# Altium project BK1096.PrjPcb
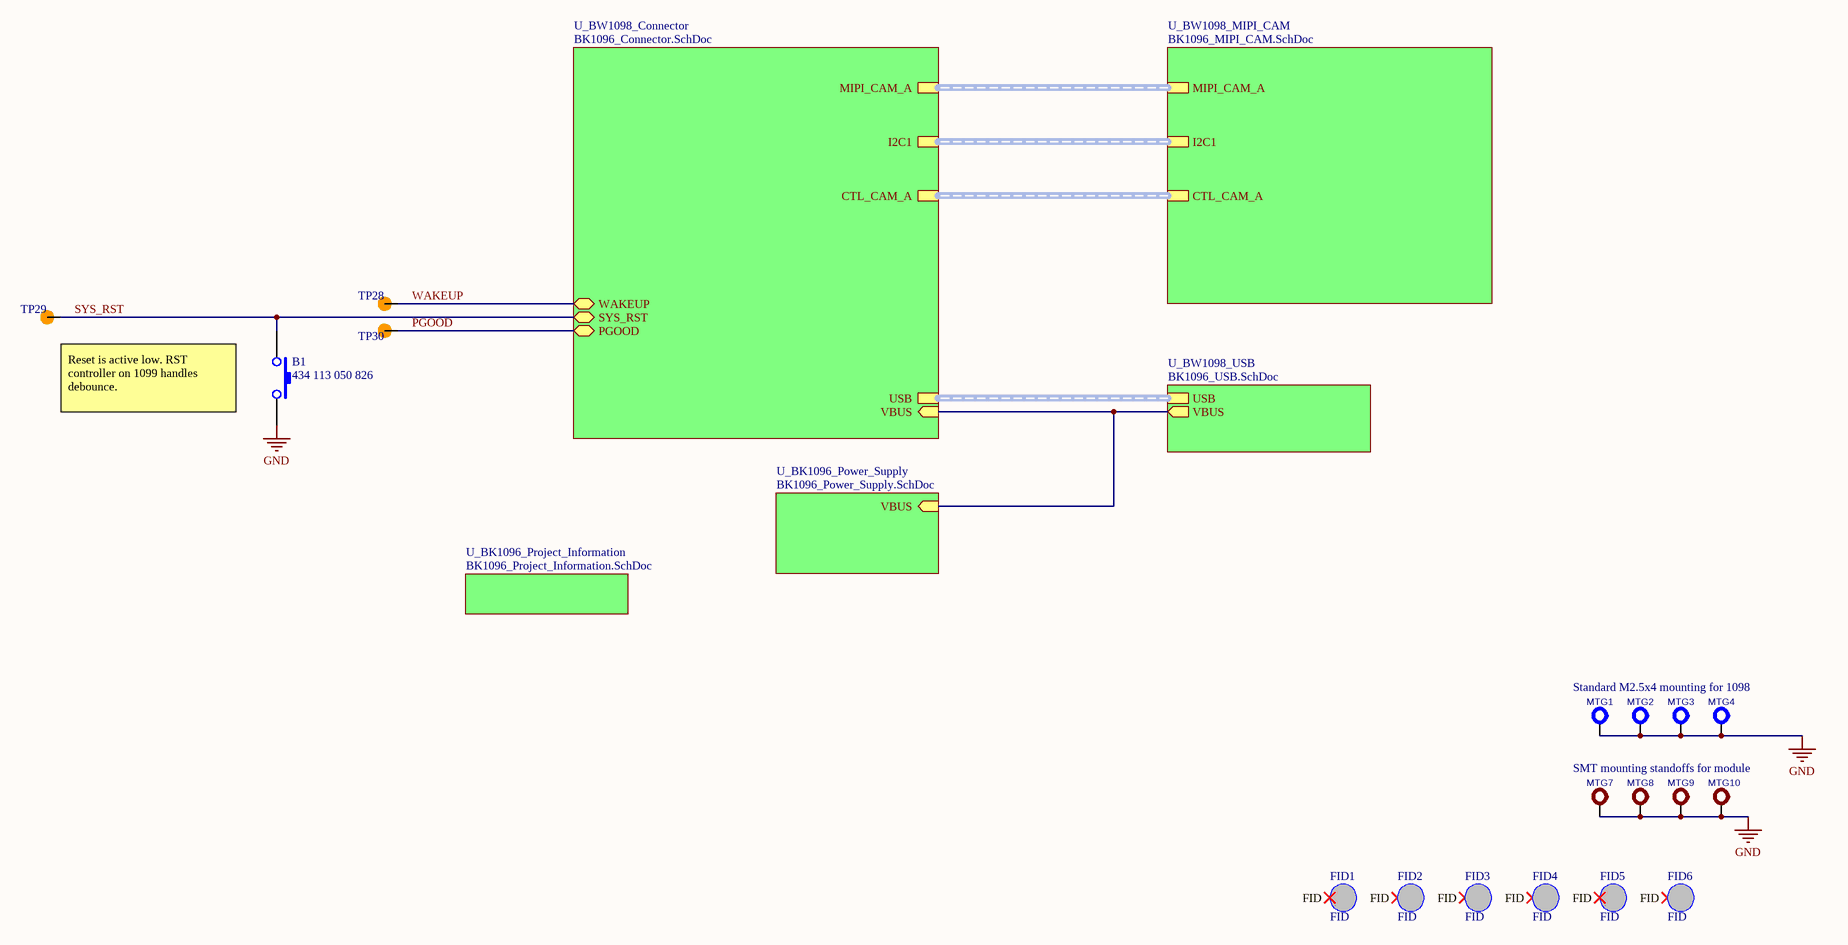
[diagram p0: BK1096_TopLevel.SchDoc]
revision1: R1M0E1; project_title: BK1096; drawn_by: Blaž Kvas; document_number: D000
6 sheets, 104 parts. Net scope: hierarchical (ports join the sheet entries above them; power ports are global).
Board file: BK1096.PcbDoc
Sheets:
  BK1096_TopLevel.SchDoc
    U_BW1098_Connector = BK1096_Connector.SchDoc
    U_BW1098_MIPI_CAM = BK1096_MIPI_CAM.SchDoc
    U_BW1098_USB = BK1096_USB.SchDoc
    U_BK1096_Power_Supply = BK1096_Power_Supply.SchDoc
    U_BK1096_Project_Information = BK1096_Project_Information.SchDoc

## Sheet BK1096_TopLevel.SchDoc: =project_title
size Tabloid; PageSetup: Record=PageOptions|CenterHorizontal=True|CenterVertical=True|PrintScale=0.73|XCorrection=1.00|YCorrection=1.00|PrintKind=0|BorderSize=5000000|LeftOffset=0|BottomOffset=0|Orientation=2|PaperLength=1000|PaperWidth=1000|Scale=100|PaperSource=7|PrintQuality=-4|MediaType=1|DitherType=10|PaperKind=A4|PrintScaleMode=1; CompanyName: Luxonis Holding; DrawnBy: Blaž Kvas; Organization: Luxonis Holding; Address1: 1925 Harmony Park Drive; Address2: Westminster, CO; Address3: 80234; Address4: United States; DocumentNumber: D000; Revision: R1M0E1; SheetNumber: 1; SheetTotal: 6

### Parts
B1  434 113 050 826  [DTSM32N]
FID1  FID  [FIDUCIAL_1MM]  (no BOM)
FID2  FID  [FIDUCIAL_1MM]  (no BOM)
FID3  FID  [FIDUCIAL_1MM]  (no BOM)
FID4  FID  [FIDUCIAL_1MM]  (no BOM)
FID5  FID  [FIDUCIAL_1MM]  (no BOM)
FID6  FID  [FIDUCIAL_1MM]  (no BOM)
MTG1  MTG-HOLE  [SCREW_M2.5x4_RPi]  (value not drawn)  (no BOM)
MTG2  MTG-HOLE  [SCREW_M2.5x4_RPi]  (value not drawn)  (no BOM)
MTG3  MTG-HOLE  [SCREW_M2.5x4_RPi]  (value not drawn)  (no BOM)
MTG4  MTG-HOLE  [SCREW_M2.5x4_RPi]  (value not drawn)  (no BOM)
MTG7  MTG-HOLE  [STANDOFF_M2X0.4_3MM]  (value not drawn)
MTG8  MTG-HOLE  [STANDOFF_M2X0.4_3MM]  (value not drawn)
MTG9  MTG-HOLE  [STANDOFF_M2X0.4_3MM]  (value not drawn)
MTG10  MTG-HOLE  [STANDOFF_M2X0.4_3MM]  (value not drawn)
TP28  TP_SMD  [TP_0.75MM_SMD_NO-SILK]  (value not drawn)  (no BOM)
TP29  TP_SMD  [TP_0.75MM_SMD_NO-SILK]  (value not drawn)  (no BOM)
TP30  TP_SMD  [TP_0.75MM_SMD_NO-SILK]  (value not drawn)  (no BOM)

### Sub-sheets
U_BK1096_Power_Supply = BK1096_Power_Supply.SchDoc: VBUS (in)
U_BK1096_Project_Information = BK1096_Project_Information.SchDoc: no entries
U_BW1098_Connector = BK1096_Connector.SchDoc: MIPI_CAM_A (harness MIPI_CAM_A), I2C1 (harness I2C1), PGOOD (bidir), SYS_RST (bidir), WAKEUP (bidir), CTL_CAM_A (harness CTL_CAM_A), USB (harness USB), VBUS (in)
U_BW1098_MIPI_CAM = BK1096_MIPI_CAM.SchDoc: I2C1 (harness I2C1), MIPI_CAM_A (harness MIPI_CAM_A), CTL_CAM_A (harness CTL_CAM_A)
U_BW1098_USB = BK1096_USB.SchDoc: USB (harness USB), VBUS (out)

### Nets
GND: B1.2 MTG1.1 MTG2.1 MTG3.1 MTG4.1 MTG7.1 MTG8.1 MTG9.1 MTG10.1
VBUS: sheet U_BW1098_Connector/VBUS, sheet U_BW1098_USB/VBUS, sheet U_BK1096_Power_Supply/VBUS
PGOOD: TP30.1 ; sheet U_BW1098_Connector/PGOOD
SYS_RST: B1.1 TP29.1 ; sheet U_BW1098_Connector/SYS_RST
WAKEUP: TP28.1 ; sheet U_BW1098_Connector/WAKEUP

Not connected (* = marked no-connect by the designer): FID1 FID*; FID2 FID*; FID3 FID*; FID4 FID*; FID5 FID*; FID6 FID*

### Buses and harness runs
harness sheet U_BW1098_Connector/CTL_CAM_A = sheet U_BW1098_MIPI_CAM/CTL_CAM_A
harness sheet U_BW1098_Connector/I2C1 = sheet U_BW1098_MIPI_CAM/I2C1
harness sheet U_BW1098_Connector/MIPI_CAM_A = sheet U_BW1098_MIPI_CAM/MIPI_CAM_A
harness sheet U_BW1098_Connector/USB = sheet U_BW1098_USB/USB

### Notes on the sheet
- Reset is active low. RST controller on 1099 handles debounce.
- Standard M2.5x4 mounting for 1098
- SMT mounting standoffs for module
- Title
- Size:
- Date:
- Tabloid
- Number:
- Time:
- Revision:
- Sheet
- of
- Drawn by:

### Library data of the parts
B1 = SW-PB: Wurth 434 113 050 826; DIST: Farnell; DIST PN: 1868029; ICCO PN: M1V00020; MAN: Wurth; MAN PN: 434 113 050 826
FID1-FID6 = FID: Fiducial mark; MAN PN: No part on PCB; MAN: Fiducial
MTG1-MTG4 = MTG-HOLE: Mounting Hole; B - Value: Not a Part; A - Level: 0; Z - SMD or PTH: PTH; F - MFG P/N: Not a Part; D - my Footprint: SCREW_M2.5x4_RPi
MTG7-MTG10 = MTG-HOLE_B: Mounting Hole; B - Value: Not a Part; A - Level: 0; Z - SMD or PTH: PTH; F - MFG P/N: Not a Part; D - my Footprint: STANDOFF_M2X0.4_3MM
TP28-TP30 = TP_SMD: circular pad test point, SMD

## Sheet BK1096_Connector.SchDoc: =project_title
size Tabloid; CompanyName: Luxonis Holding; DrawnBy: Blaž Kvas; Organization: Luxonis Holding; Address1: 1925 Harmony Park Drive; Address2: Westminster, CO; Address3: 80234; Address4: United States; DocumentNumber: D000; Revision: R1M0E1; SheetNumber: 3; SheetTotal: 6
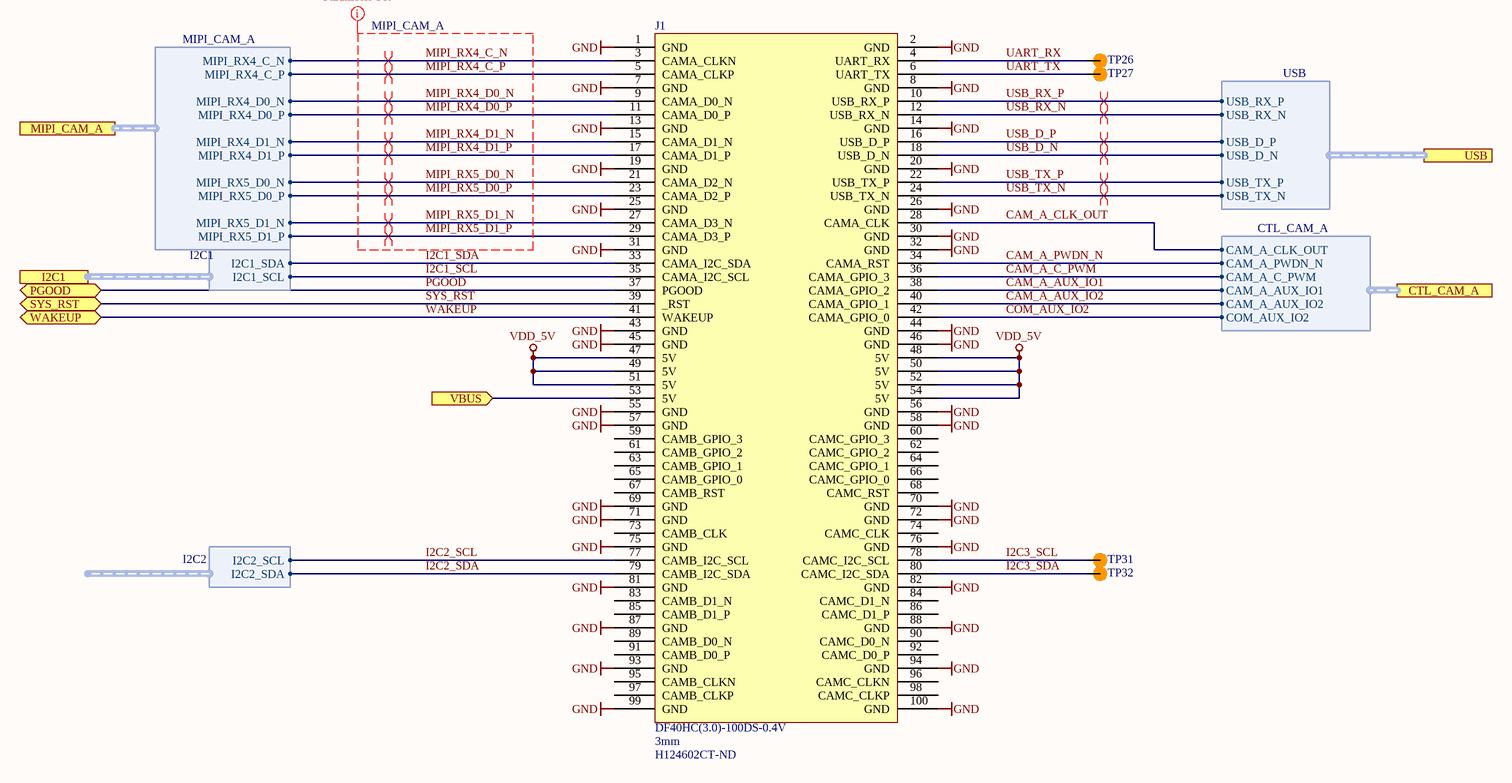
[diagram p1: BK1096_Connector.SchDoc]

### Parts
J1  DF40HC(3.0)-100DS-0.4V  Mated Stacking Heights: 3mm  Supplier Part Number 1: H124602CT-ND  [DF40HC-3.0-100DS-0.4V]
TP26  TP_SMD  [TP_0.75MM_SMD_NO-SILK]  (value not drawn)  (no BOM)
TP27  TP_SMD  [TP_0.75MM_SMD_NO-SILK]  (value not drawn)  (no BOM)
TP31  TP_SMD  [TP_0.75MM_SMD_NO-SILK]  (value not drawn)  (no BOM)
TP32  TP_SMD  [TP_0.75MM_SMD_NO-SILK]  (value not drawn)  (no BOM)

### Ports
CTL_CAM_A (harness CTL_CAM_A), I2C1 (harness I2C1), MIPI_CAM_A (harness MIPI_CAM_A), PGOOD (bidir), SYS_RST (bidir), USB (harness USB), VBUS (in), WAKEUP (bidir)

### Harnesses
MIPI_CAM_A: MIPI_RX4_C_P, MIPI_RX4_C_N, MIPI_RX4_D0_P, MIPI_RX4_D0_N, MIPI_RX4_D1_P, MIPI_RX4_D1_N, MIPI_RX5_D0_P, MIPI_RX5_D0_N, MIPI_RX5_D1_P, MIPI_RX5_D1_N
I2C2: I2C2_SDA, I2C2_SCL
I2C1: I2C1_SDA, I2C1_SCL
USB: USB_D_P, USB_D_N, USB_TX_N, USB_TX_P, USB_RX_N, USB_RX_P
CTL_CAM_A: CAM_A_C_PWM, CAM_A_AUX_IO1, CAM_A_AUX_IO2, COM_AUX_IO2, CAM_A_PWDN_N, CAM_A_CLK_OUT

### Nets
GND: J1.1(GND) J1.2(GND) J1.7(GND) J1.8(GND) J1.13(GND) J1.14(GND) J1.19(GND) J1.20(GND) J1.25(GND) J1.26(GND) J1.30(GND) J1.31(GND) J1.32(GND) J1.43(GND) J1.44(GND) J1.45(GND) J1.46(GND) J1.55(GND) J1.56(GND) J1.57(GND) J1.58(GND) J1.69(GND) J1.70(GND) J1.71(GND) J1.72(GND) J1.75(GND) J1.76(GND) J1.81(GND) J1.82(GND) J1.87(GND) J1.88(GND) J1.93(GND) J1.94(GND) J1.99(GND) J1.100(GND)
VBUS: J1.53(5V) ; port VBUS
VDD_5V: J1.47(5V) J1.48(5V) J1.49(5V) J1.50(5V) J1.51(5V) J1.52(5V) J1.54(5V)
CAM_A_AUX_IO1: J1.38(CAMA_GPIO_2) ; port CTL_CAM_A.CAM_A_AUX_IO1
CAM_A_AUX_IO2: J1.40(CAMA_GPIO_1) ; port CTL_CAM_A.CAM_A_AUX_IO2
CAM_A_C_PWM: J1.36(CAMA_GPIO_3) ; port CTL_CAM_A.CAM_A_C_PWM
CAM_A_CLK_OUT: J1.28(CAMA_CLK) ; port CTL_CAM_A.CAM_A_CLK_OUT
CAM_A_PWDN_N: J1.34(CAMA_RST) ; port CTL_CAM_A.CAM_A_PWDN_N
COM_AUX_IO2: J1.42(CAMA_GPIO_0) ; port CTL_CAM_A.COM_AUX_IO2
I2C1_SCL: J1.35(CAMA_I2C_SCL) ; port I2C1.I2C1_SCL
I2C1_SDA: J1.33(CAMA_I2C_SDA) ; port I2C1.I2C1_SDA
I2C2_SCL: J1.77(CAMB_I2C_SCL) ; harness I2C2.I2C2_SCL
I2C2_SDA: J1.79(CAMB_I2C_SDA) ; harness I2C2.I2C2_SDA
I2C3_SCL: J1.78(CAMC_I2C_SCL) TP31.1
I2C3_SDA: J1.80(CAMC_I2C_SDA) TP32.1
MIPI_RX4_C_N: J1.3(CAMA_CLKN) ; port MIPI_CAM_A.MIPI_RX4_C_N
MIPI_RX4_C_P: J1.5(CAMA_CLKP) ; port MIPI_CAM_A.MIPI_RX4_C_P
MIPI_RX4_D0_N: J1.9(CAMA_D0_N) ; port MIPI_CAM_A.MIPI_RX4_D0_N
MIPI_RX4_D0_P: J1.11(CAMA_D0_P) ; port MIPI_CAM_A.MIPI_RX4_D0_P
MIPI_RX4_D1_N: J1.15(CAMA_D1_N) ; port MIPI_CAM_A.MIPI_RX4_D1_N
MIPI_RX4_D1_P: J1.17(CAMA_D1_P) ; port MIPI_CAM_A.MIPI_RX4_D1_P
MIPI_RX5_D0_N: J1.21(CAMA_D2_N) ; port MIPI_CAM_A.MIPI_RX5_D0_N
MIPI_RX5_D0_P: J1.23(CAMA_D2_P) ; port MIPI_CAM_A.MIPI_RX5_D0_P
MIPI_RX5_D1_N: J1.27(CAMA_D3_N) ; port MIPI_CAM_A.MIPI_RX5_D1_N
MIPI_RX5_D1_P: J1.29(CAMA_D3_P) ; port MIPI_CAM_A.MIPI_RX5_D1_P
PGOOD: J1.37(PGOOD) ; port PGOOD
SYS_RST: J1.39(_RST) ; port SYS_RST
UART_RX: J1.4(UART_RX) TP26.1
UART_TX: J1.6(UART_TX) TP27.1
USB_D_N: J1.18(USB_D_N) ; port USB.USB_D_N
USB_D_P: J1.16(USB_D_P) ; port USB.USB_D_P
USB_RX_N: J1.12(USB_RX_N) ; port USB.USB_RX_N
USB_RX_P: J1.10(USB_RX_P) ; port USB.USB_RX_P
USB_TX_N: J1.24(USB_TX_N) ; port USB.USB_TX_N
USB_TX_P: J1.22(USB_TX_P) ; port USB.USB_TX_P
WAKEUP: J1.41(WAKEUP) ; port WAKEUP

Not connected (* = marked no-connect by the designer): J1 59(CAMB_GPIO_3) 60(CAMC_GPIO_3) 61(CAMB_GPIO_2) 62(CAMC_GPIO_2) 63(CAMB_GPIO_1) 64(CAMC_GPIO_1) 65(CAMB_GPIO_0) 66(CAMC_GPIO_0) 67(CAMB_RST) 68(CAMC_RST) 73(CAMB_CLK) 74(CAMC_CLK) 83(CAMB_D1_N) 84(CAMC_D1_N) 85(CAMB_D1_P) 86(CAMC_D1_P) 89(CAMB_D0_N) 90(CAMC_D0_N) 91(CAMB_D0_P) 92(CAMC_D0_P) 95(CAMB_CLKN) 96(CAMC_CLKN) 97(CAMB_CLKP) 98(CAMC_CLKP)

### Layout directives
differential pair; differential pair class USB_D: USB_D_N, USB_D_P
differential pair; differential pair class USB_RxTX: USB_RX_N, USB_RX_P, USB_TX_N, USB_TX_P
differential pair; differential pair class MIPI_CAMS: MIPI_RX4_C_N, MIPI_RX4_C_P, MIPI_RX4_D0_N, MIPI_RX4_D0_P, MIPI_RX4_D1_N, MIPI_RX4_D1_P, MIPI_RX5_D0_N, MIPI_RX5_D0_P, MIPI_RX5_D1_N, MIPI_RX5_D1_P
net class MIPI_CAM_A; rule Matched Net Lengths [Tolerance = 5mil]: MIPI_RX4_C_N, MIPI_RX4_C_P, MIPI_RX4_D0_N, MIPI_RX4_D0_P, MIPI_RX4_D1_N, MIPI_RX4_D1_P, MIPI_RX5_D0_N, MIPI_RX5_D0_P, MIPI_RX5_D1_N, MIPI_RX5_D1_P

### Notes on the sheet
- Title
- Size:
- Date:
- Tabloid
- Number:
- Time:
- Revision:
- Sheet
- of
- Drawn by:

### Library data of the parts
J1 = DF40HC(3.0)-100DS-0.4V: CONN RCPT 100POS 0.4MM SMD GOLD; Manufacturer 1: Hirose; Manufacturer Part Number 1: DF40HC(3.0)-100DS-0.4V(58; Connector Type: Receptacle; Number of Positions: 100; Pitch: 0.016inch; Supplier 1: Digi-Key; Stock 1: 867; Pricing 1: 1=2.75000, 10=2.64000, 25=2.42000, 50=2.31000, 100=2.20000, 250=1.92500, 500=1.87000 (USD); RoHS: Yes; Mount: Surface Mount; Contact Plating: Gold; Packaging: Tape and Reel; Number of Rows: 2; Package Quantity: 1000; Lead Free: Lead Free; ComponentLink1URL: https://datasheet.ciiva.com/46636/ed-df40-20140305-46636517.pdf?src-supplier=Digi-Key; ComponentLink1Description: https://datasheet.ciiva.com/46636/ed-df40-20140305-46636517.pdf?src-supplier=Digi-Key; ComponentLink2URL: https://datasheet.ciiva.com/18562/ed-df40-20140305-18562189.pdf?src-supplier=Digi-Key; ComponentLink2Description: https://datasheet.ciiva.com/18562/ed-df40-20140305-18562189.pdf?src-supplier=Digi-Key
TP26 TP27 TP31 TP32 = TP_SMD: circular pad test point, SMD

## Sheet BK1096_MIPI_CAM.SchDoc: =project_title
size Tabloid; PageSetup: Record=PageOptions|CenterHorizontal=True|CenterVertical=True|PrintScale=0.73|XCorrection=1.00|YCorrection=1.00|PrintKind=0|BorderSize=5000000|LeftOffset=0|BottomOffset=0|Orientation=2|PaperLength=1000|PaperWidth=1000|Scale=100|PaperSource=7|PrintQuality=-4|MediaType=1|DitherType=10|PaperKind=A4|PrintScaleMode=1; CompanyName: Luxonis Holding; DrawnBy: Blaž Kvas; Organization: Luxonis Holding; Address1: 1925 Harmony Park Drive; Address2: Westminster, CO; Address3: 80234; Address4: United States; DocumentNumber: D000; Revision: R1M0E1; SheetNumber: 4; SheetTotal: 6
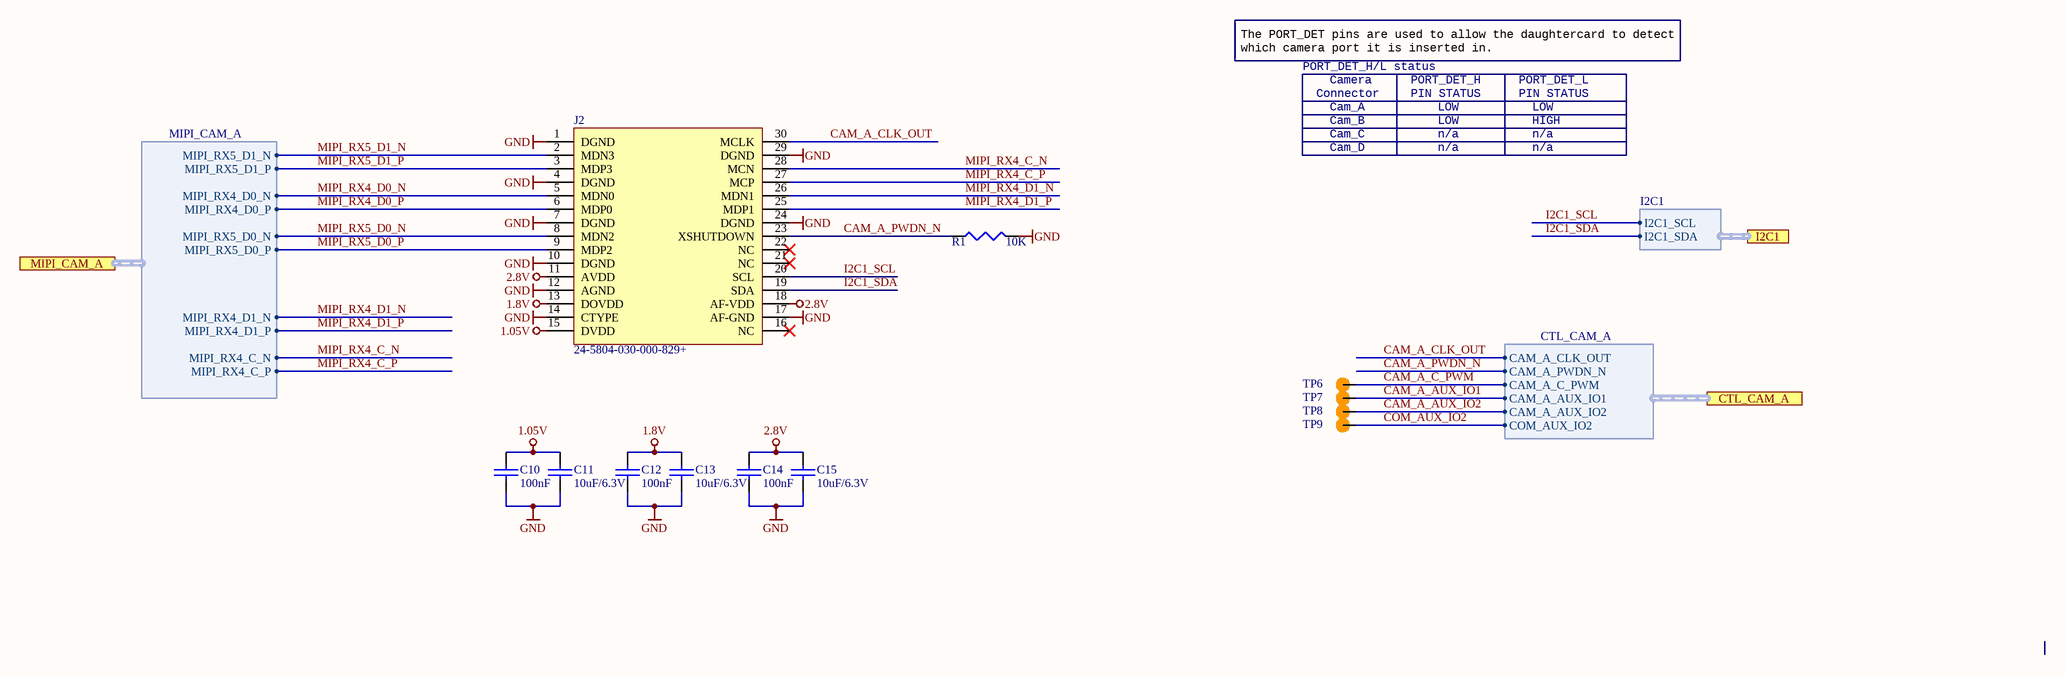
[diagram p2: BK1096_MIPI_CAM.SchDoc]

### Parts
C10  100nF  [CAPC0402(1005)60_N]
C11  10uF/6.3V  [CAPC0603(1608)55_N]
C12  100nF  [CAPC0402(1005)60_N]
C13  10uF/6.3V  [CAPC0603(1608)55_N]
C14  100nF  [CAPC0402(1005)60_N]
C15  10uF/6.3V  [CAPC0603(1608)55_N]
J2  24-5804-030-000-829+  [A12N02A-201_MatedModule]
R1  10K  [RESC0603(1608)_N]
TP6  TP_SMD  [TP_0.75MM_SMD_NO-SILK]  (value not drawn)  (no BOM)
TP7  TP_SMD  [TP_0.75MM_SMD_NO-SILK]  (value not drawn)  (no BOM)
TP8  TP_SMD  [TP_0.75MM_SMD_NO-SILK]  (value not drawn)  (no BOM)
TP9  TP_SMD  [TP_0.75MM_SMD_NO-SILK]  (value not drawn)  (no BOM)

### Ports
CTL_CAM_A (harness CTL_CAM_A), I2C1 (harness I2C1), MIPI_CAM_A (harness MIPI_CAM_A)

### Harnesses
I2C1: I2C1_SDA, I2C1_SCL
MIPI_CAM_A: MIPI_RX4_D0_P, MIPI_RX4_D0_N, MIPI_RX4_D1_P, MIPI_RX4_D1_N, MIPI_RX4_C_N, MIPI_RX4_C_P, MIPI_RX5_D1_P, MIPI_RX5_D1_N, MIPI_RX5_D0_P, MIPI_RX5_D0_N
CTL_CAM_A: CAM_A_C_PWM, CAM_A_AUX_IO1, CAM_A_AUX_IO2, COM_AUX_IO2, CAM_A_PWDN_N, CAM_A_CLK_OUT

### Nets
1.05V: C10.2 C11.2 J2.15(DVDD)
1.8V: C12.2 C13.2 J2.13(DOVDD)
2.8V: C14.2 C15.2 J2.11(AVDD) J2.18(AF-VDD)
GND: C10.1 C11.1 C12.1 C13.1 C14.1 C15.1 J2.1(DGND) J2.4(DGND) J2.7(DGND) J2.10(DGND) J2.12(AGND) J2.14(CTYPE) J2.17(AF-GND) J2.24(DGND) J2.29(DGND) R1.2
CAM_A_AUX_IO1: TP7.1 ; port CTL_CAM_A.CAM_A_AUX_IO1
CAM_A_AUX_IO2: TP8.1 ; port CTL_CAM_A.CAM_A_AUX_IO2
CAM_A_C_PWM: TP6.1 ; port CTL_CAM_A.CAM_A_C_PWM
CAM_A_CLK_OUT: J2.30(MCLK) ; port CTL_CAM_A.CAM_A_CLK_OUT
CAM_A_PWDN_N: J2.23(XSHUTDOWN) R1.1 ; port CTL_CAM_A.CAM_A_PWDN_N
COM_AUX_IO2: TP9.1 ; port CTL_CAM_A.COM_AUX_IO2
I2C1_SCL: J2.20(SCL) ; port I2C1.I2C1_SCL
I2C1_SDA: J2.19(SDA) ; port I2C1.I2C1_SDA
MIPI_RX4_C_N: J2.28(MCN) ; port MIPI_CAM_A.MIPI_RX4_C_N
MIPI_RX4_C_P: J2.27(MCP) ; port MIPI_CAM_A.MIPI_RX4_C_P
MIPI_RX4_D0_N: J2.5(MDN0) ; port MIPI_CAM_A.MIPI_RX4_D0_N
MIPI_RX4_D0_P: J2.6(MDP0) ; port MIPI_CAM_A.MIPI_RX4_D0_P
MIPI_RX4_D1_N: J2.26(MDN1) ; port MIPI_CAM_A.MIPI_RX4_D1_N
MIPI_RX4_D1_P: J2.25(MDP1) ; port MIPI_CAM_A.MIPI_RX4_D1_P
MIPI_RX5_D0_N: J2.8(MDN2) ; port MIPI_CAM_A.MIPI_RX5_D0_N
MIPI_RX5_D0_P: J2.9(MDP2) ; port MIPI_CAM_A.MIPI_RX5_D0_P
MIPI_RX5_D1_N: J2.2(MDN3) ; port MIPI_CAM_A.MIPI_RX5_D1_N
MIPI_RX5_D1_P: J2.3(MDP3) ; port MIPI_CAM_A.MIPI_RX5_D1_P

Not connected (* = marked no-connect by the designer): J2 16(NC)* 21(NC)* 22(NC)*

### Notes on the sheet
- The PORT_DET pins are used to allow the daughtercard to detect which camera port it is inserted in.
- PORT_DET_H/L status
- Connector
- Camera
- PORT_DET_H
- PIN STATUS
- PORT_DET_L
- Cam_A
- Cam_B
- Cam_C
- Cam_D
- LOW
- n/a
- HIGH
- Title
- Size:
- Date:
- Tabloid
- Number:
- Time:
- Revision:
- Sheet
- of
- Drawn by:

### Library data of the parts
C10 C12 C14 = CAP: SMD Multilayer Ceramic Capacitor, 0402 [1005 Metric], 0.1 µF, 10 V, ± 10%, X5R; MAN: Kemet; MAN PN: C0402C104K8PACTU; ICCO PN: MV122005; DIST: Farnell; DIST PN: 2392235
C11 C13 C15 = CAP: SMD Multilayer Ceramic Capacitor, 0603 [1608 Metric], 10 µF, 6.3 V, ± 20%, X5R; MAN: Yageo(PHYCOM); MAN PN: CC0603MRX5R5BB106; ICCO PN: MV122009; DIST: Farnell; DIST PN: 1458902
J2 = A12N02A-201: Series 5804 board to board 0.4mm pitch 30 way connector; MAN: AVX/KYOCERA; MAN PN: 24-5804-030-000-829+
R1 = RES1: SMD Chip Resistor, 10 kohm, 75 V, 0603 [1608 Metric], 100 mW, ± 1%; MAN: WALSIN; MAN PN: WR06X1002FTL; ICCO PN: MV122008; DIST: Farnell; DIST PN: 2502397
TP6-TP9 = TP_SMD: circular pad test point, SMD

## Sheet BK1096_USB.SchDoc: =project_title
size Tabloid; PageSetup: Record=PageOptions|CenterHorizontal=True|CenterVertical=True|PrintScale=0.73|XCorrection=1.00|YCorrection=1.00|PrintKind=0|BorderSize=5000000|LeftOffset=0|BottomOffset=0|Orientation=2|PaperLength=1000|PaperWidth=1000|Scale=100|PaperSource=7|PrintQuality=-4|MediaType=1|DitherType=10|PaperKind=A4|PrintScaleMode=1; CompanyName: Luxonis Holding; DrawnBy: Blaž Kvas; Organization: Luxonis Holding; Address1: 1925 Harmony Park Drive; Address2: Westminster, CO; Address3: 80234; Address4: United States; DocumentNumber: D000; Revision: R1M0E1; SheetNumber: 6; SheetTotal: 6
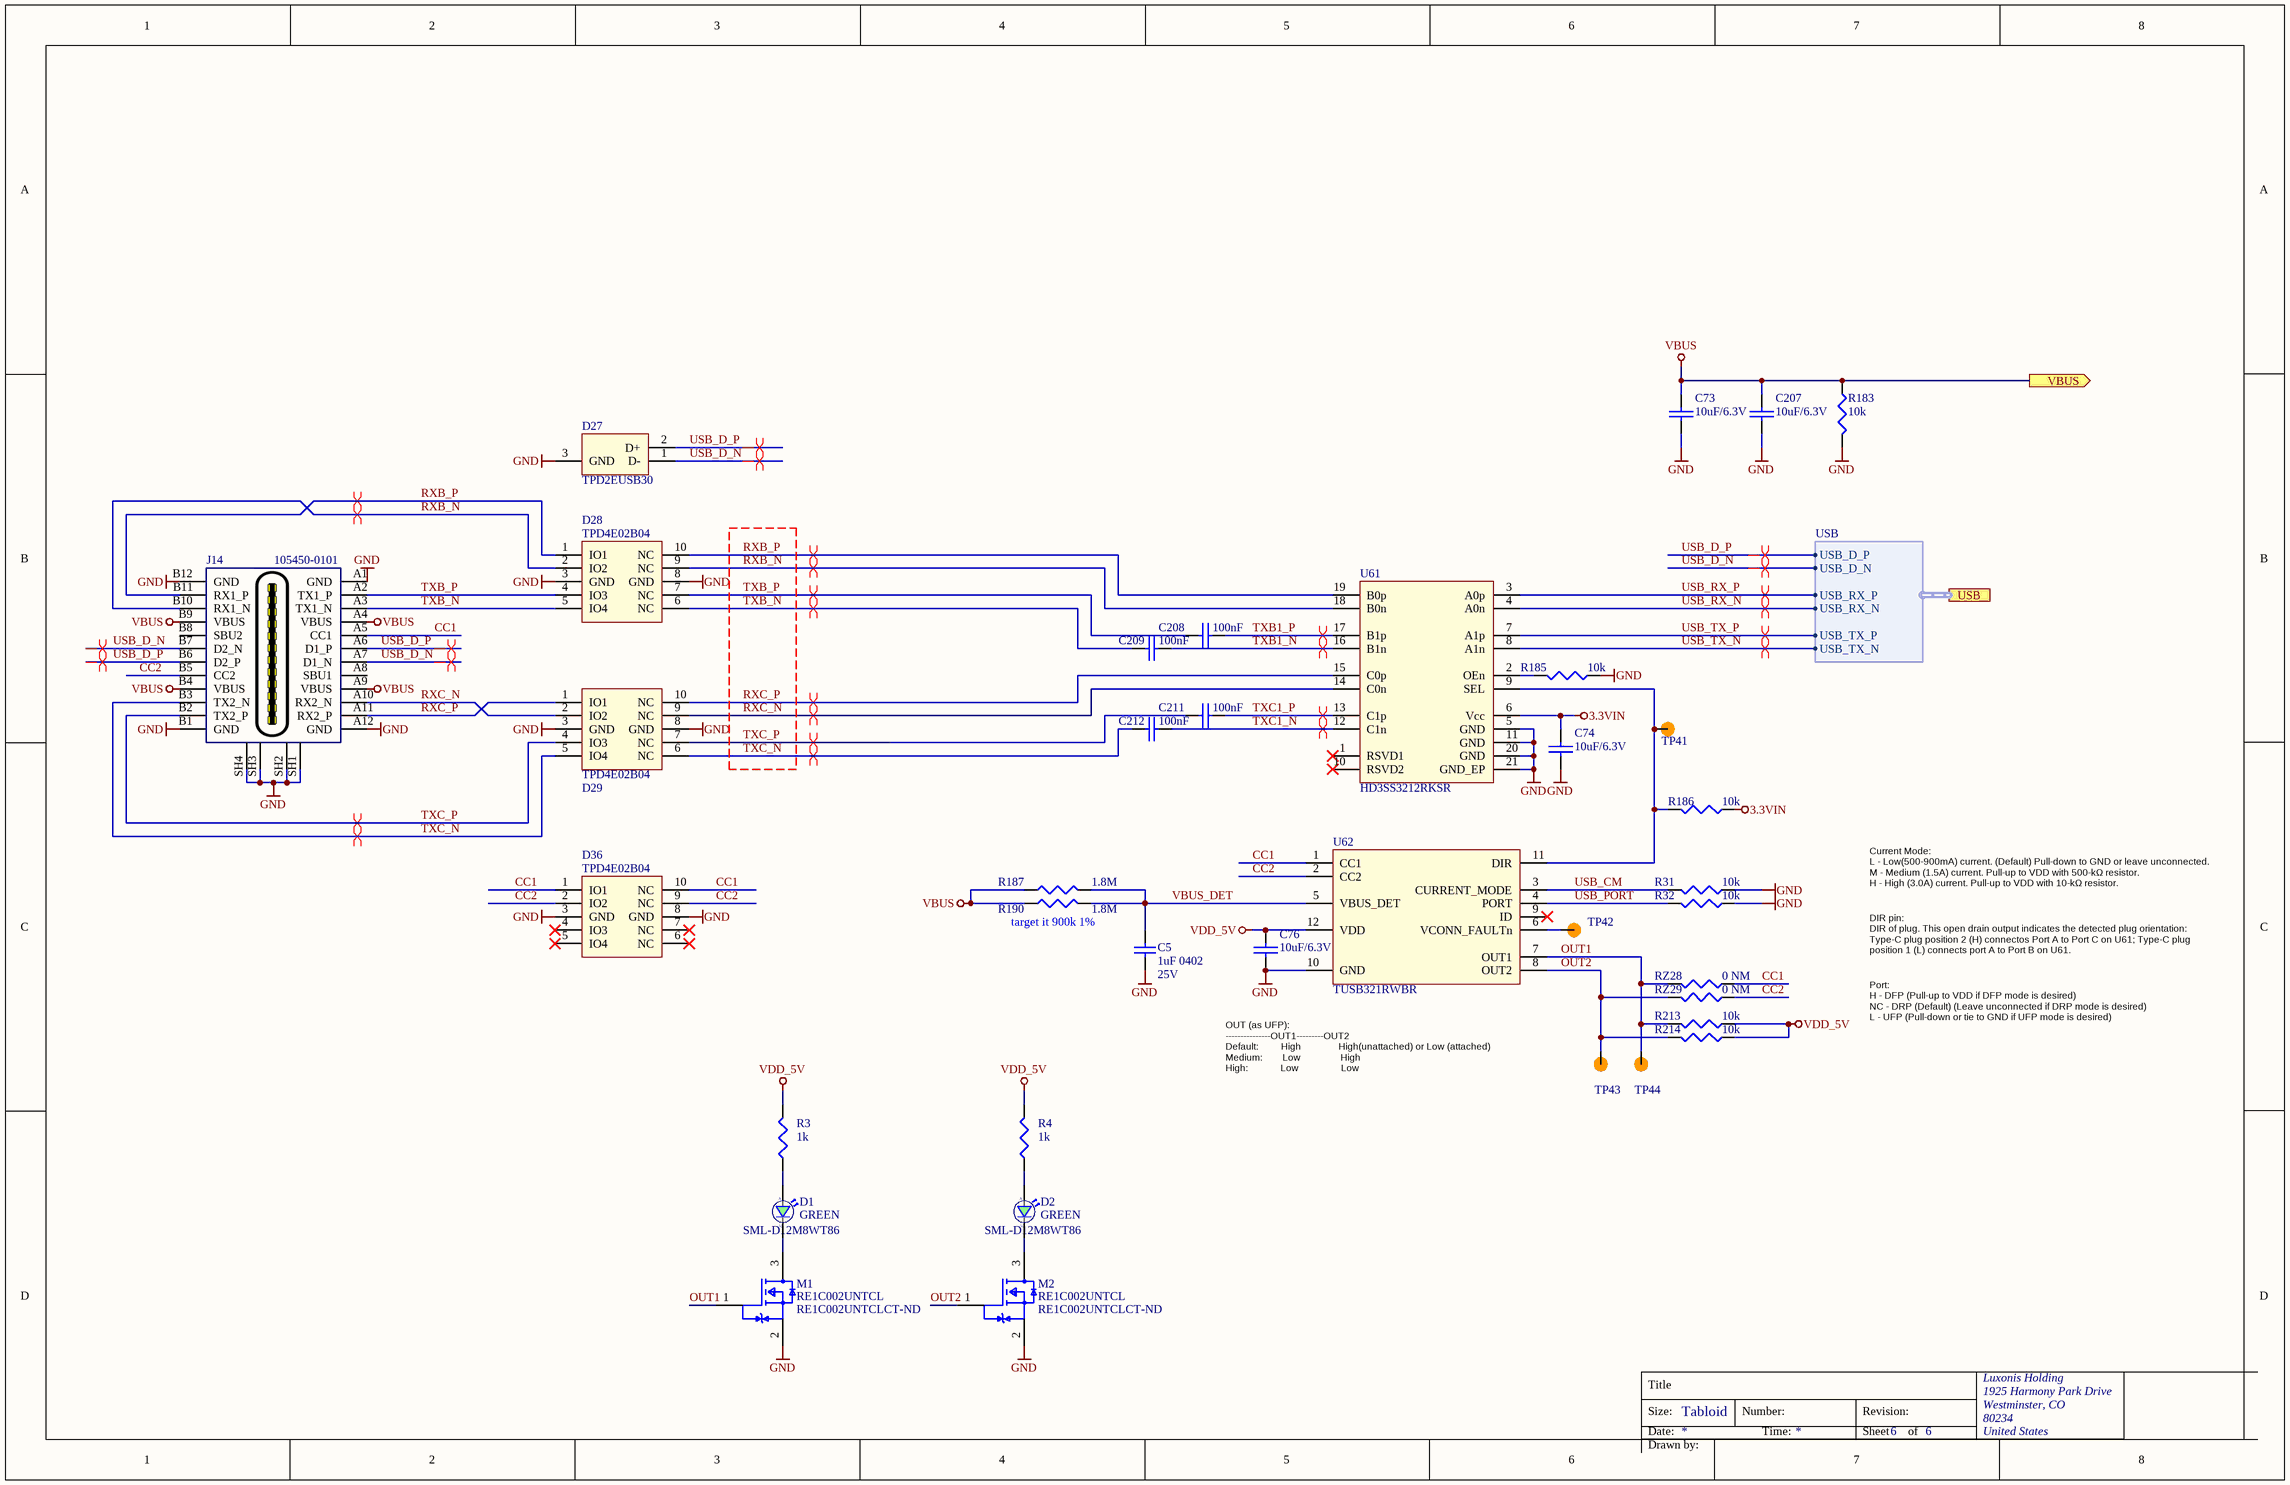
[diagram p3: BK1096_USB.SchDoc]

### Parts
C5  1uF 0402  Voltage Rating: 25V  [CAPC0402(1005)70_N]
C73  10uF/6.3V  [CAPC0402(1005)60_N]
C74  10uF/6.3V  [CAPC0402(1005)60_N]
C76  10uF/6.3V  [CAPC0402(1005)60_N]
C207  10uF/6.3V  [CAPC0402(1005)60_N]
C208  100nF  [CAPC0201(0603)33_L]
C209  100nF  [CAPC0201(0603)33_L]
C211  100nF  [CAPC0201(0603)33_L]
C212  100nF  [CAPC0201(0603)33_L]
D1  GREEN  Manufacturer Part Number: SML-D12M8WT86  [LED_0603]
D2  GREEN  Manufacturer Part Number: SML-D12M8WT86  [LED_0603]
D27  TPD2EUSB30  [SOT-3]
D28  TPD4E02B04  [DQA-10]
D29  TPD4E02B04  [DQA-10]
D36  TPD4E02B04  [DQA-10]
J14  105450-0101  [Molex_105450-0101]
M1  RE1C002UNTCL  Supplier Part Number 1: RE1C002UNTCLCT-ND  [SOT-416FL]
M2  RE1C002UNTCL  Supplier Part Number 1: RE1C002UNTCLCT-ND  [SOT-416FL]
R3  1k  [RESC0402(1005)_N]
R4  1k  [RESC0402(1005)_N]
R31  10k  [RESC0402(1005)_N]
R32  10k  [RESC0402(1005)_N]
R183  10k  [RESC0402(1005)_N]
R185  10k  [RESC0402(1005)_N]
R186  10k  [RESC0402(1005)_N]
R187  1.8M  [RESC0402(1005)_N]
R190  1.8M  [RESC0402(1005)_N]
R213  10k  [RESC0402(1005)_N]
R214  10k  [RESC0402(1005)_N]
RZ28  0 NM  [RESC0603(1608)_N]
RZ29  0 NM  [RESC0603(1608)_N]
TP41  TP_SMD  [TP_0.75MM_SMD_NO-SILK]  (value not drawn)  (no BOM)
TP42  TP_SMD  [TP_0.75MM_SMD_NO-SILK]  (value not drawn)  (no BOM)
TP43  TP_SMD  [TP_0.75MM_SMD_NO-SILK]  (value not drawn)  (no BOM)
TP44  TP_SMD  [TP_0.75MM_SMD_NO-SILK]  (value not drawn)  (no BOM)
U61  HD3SS3212RKSR  [VQFN-20]
U62  TUSB321RWBR  [X2QFN-12]

### Ports
USB (harness USB), VBUS (out)

### Harnesses
USB: USB_D_P, USB_D_N, USB_TX_N, USB_TX_P, USB_RX_N, USB_RX_P

### Nets
3.3VIN: C74.2 R186.2 U61.6(Vcc)
GND: C5.1 C73.1 C74.1 C76.1 C207.1 D27.3(GND) D28.3(GND) D28.8(GND) D29.3(GND) D29.8(GND) D36.3(GND) D36.8(GND) J14.A1(GND) J14.A12(GND) J14.B1(GND) J14.B12(GND) J14.SH1(SH) J14.SH2(SH) J14.SH3(SH) J14.SH4(SH) M1.2(Source) M2.2(Source) R31.2 R32.2 R183.1 R185.2 U61.5(GND) U61.11(GND) U61.20(GND) U61.21(GND_EP) U62.10(GND)
VBUS: C73.2 C207.2 J14.A4(VBUS) J14.A9(VBUS) J14.B4(VBUS) J14.B9(VBUS) R183.2 R187.2 R190.2 ; port VBUS
VDD_5V: C76.2 R3.2 R4.2 R213.2 R214.2 U62.12(VDD)
CC1: D36.1(IO1) D36.10(NC) J14.A5(CC1) RZ28.1 U62.1(CC1)
CC2: D36.2(IO2) D36.9(NC) J14.B5(CC2) RZ29.1 U62.2(CC2)
OUT1: M1.1(Gate) R213.1 RZ28.2 TP44.1 U62.7(OUT1)
OUT2: M2.1(Gate) R214.1 RZ29.2 TP43.1 U62.8(OUT2)
RXB_N: D28.2(IO2) D28.9(NC) J14.B10(RX1_N) U61.18(B0n)
RXB_P: D28.1(IO1) D28.10(NC) J14.B11(RX1_P) U61.19(B0p)
RXC_N: D29.2(IO2) D29.9(NC) J14.A10(RX2_N) U61.14(C0n)
RXC_P: D29.1(IO1) D29.10(NC) J14.A11(RX2_P) U61.15(C0p)
TXB1_N: C209.1 U61.16(B1n)
TXB1_P: C208.1 U61.17(B1p)
TXB_N: C209.2 D28.5(IO4) D28.6(NC) J14.A3(TX1_N)
TXB_P: C208.2 D28.4(IO3) D28.7(NC) J14.A2(TX1_P)
TXC1_N: C212.1 U61.12(C1n)
TXC1_P: C211.1 U61.13(C1p)
TXC_N: C212.2 D29.5(IO4) D29.6(NC) J14.B3(TX2_N)
TXC_P: C211.2 D29.4(IO3) D29.7(NC) J14.B2(TX2_P)
USB_CM: R31.1 U62.3(CURRENT_MODE)
USB_D_N: D27.1(D-) J14.A7(D1_N) J14.B7(D2_N) ; port USB.USB_D_N
USB_D_P: D27.2(D+) J14.A6(D1_P) J14.B6(D2_P) ; port USB.USB_D_P
USB_PORT: R32.1 U62.4(PORT)
USB_RX_N: U61.4(A0n) ; port USB.USB_RX_N
USB_RX_P: U61.3(A0p) ; port USB.USB_RX_P
USB_TX_N: U61.8(A1n) ; port USB.USB_TX_N
USB_TX_P: U61.7(A1p) ; port USB.USB_TX_P
VBUS_DET: C5.2 R187.1 R190.1 U62.5(VBUS_DET)
NetD1_1: D1.1(C) M1.3(Drain)
NetD1_2: D1.2(A) R3.1
NetD2_1: D2.1(C) M2.3(Drain)
NetD2_2: D2.2(A) R4.1
NetR185_1: R185.1 U61.2(OEn)
NetR186_1: R186.1 TP41.1 U61.9(SEL) U62.11(DIR)
NetTP42_1: TP42.1 U62.6(VCONN_FAULTn)

Not connected (* = marked no-connect by the designer): D36 4(IO3)* 5(IO4)* 6(NC)* 7(NC)*; J14 A8(SBU1) B8(SBU2); U61 1(RSVD1)* 10(RSVD2)*; U62 9(ID)*

### Layout directives
differential pair; differential pair class USB3: RXB_N, RXB_P, RXC_N, RXC_P, TXB1_N, TXB1_P, TXB_N, TXB_P, TXC1_N, TXC1_P, TXC_N, TXC_P, USB_RX_N, USB_RX_P, USB_TX_N, USB_TX_P
differential pair; differential pair class USB_D: USB_D_N, USB_D_P

### Notes on the sheet
- Current Mode:
  L - Low(500-900mA) current. (Default) Pull-down to GND or leave unconnected.
  M - Medium (1.5A) current. Pull-up to VDD with 500-kΩ resistor.
  H - High (3.0A) current. Pull-up to VDD with 10-kΩ resistor.
- (near R190) target it 900k 1%
- DIR pin:
  DIR of plug. This open drain output indicates the detected plug orientation: Type-C plug position 2 (H) connectos Port A to Port C on U61; Type-C plug position 1 (L) connects port A to Port B on U61.
- Port:
  H - DFP (Pull-up to VDD if DFP mode is desired)
  NC - DRP (Default) (Leave unconnected if DRP mode is desired)
  L - UFP (Pull-down or tie to GND if UFP mode is desired)
- OUT (as UFP):
  ---------------OUT1---------OUT2
  Default:         High               High(unattached) or Low (attached)
  Medium:        Low                High
  High:             Low                 Low
- Title
- Size:
- Date:
- Tabloid
- Number:
- Time:
- Revision:
- Sheet
- of
- Drawn by:

### Library data of the parts
C5 = GRM155R61E105KA12D: CAP CER 1UF 25V X5R 0402 10%; Manufacturer 1: Murata; Material: Ceramic; Supplier 1: Digi-Key; Manufacturer Part Number 1: GRM155R61E105KA12D; Stock 1: 200653; Pricing 1: 1=0.10000, 10=0.07100, 100=0.03350, 500=0.02352, 1000=0.01947, 2500=0.01812, 5000=0.01658 (USD); RoHS: Yes; Mount: Surface Mount; Case/Package: 0402; Weight: 0.000212oz; Case Code (Metric): 1005; Case Code (Imperial): 0402; Min Operating Temperature: -55°C; Max Operating Temperature: 85°C; Tolerance: 10%; Capacitance: 1uF; Dielectric: X5R; Voltage Rating (DC): 25V; Packaging: Tape and Reel; Package Quantity: 10000; Termination: SMD/SMT; Voltage: 25V; Length: 1mm; Height: 0.5mm; Width: 0.5mm; Thickness: 0.022inch; Depth: 0.5mm; Lead Free: Lead Free; REACH SVHC: No SVHC; ComponentLink1URL: https://datasheet.ciiva.com/22732/1666664-22732122.pdf?src-supplier=Element14; ComponentLink1Description: https://datasheet.ciiva.com/22732/1666664-22732122.pdf?src-supplier=Element14; ComponentLink2URL: https://datasheet.ciiva.com/7719/1666664-7719006.pdf?src-supplier=Element14; ComponentLink2Description: https://datasheet.ciiva.com/7719/1666664-7719006.pdf?src-supplier=Element14; Supplier Part Number 1: 490-10017-1-ND; Supplier 2: Arrow; Supplier 3: TTI; Supplier Part Number 2: GRM155R61E105KA12D; Supplier Part Number 3: GRM155R61E105KA12D
C73 C74 C76 C207 = CAP: SMD Multilayer Ceramic Capacitor, 0402 [1005 Metric], 10 µF, 6.3 V, ± 20%, X5R; E - MFG: MuRata; F - MFG P/N: GRM155R60J106ME44D; D - my Footprint: CAPC0402(1005)60_N
C208 C209 C211 C212 = CAP: SMD Multilayer Ceramic Capacitor, 0201 [0603 Metric], 0.1 µF, 6.3 V, ± 10%, X5R; B - Value: 0.1uF; C - Notes: 0201  0.1 µF, 6.3 V, ± 10%, X5R; E - MFG: MuRata; F - MFG P/N: GRM033R60J104KE19D; D - my Footprint: CAPC0201(0603)33_L
D1 D2 = LED_GREEN_0603: LED GREEN DIFFUSED 0603 SMD; Manufacturer: Rohm; Colour: Green,Yellow; Lens Colour: White,Clear,Diffused; Lens Style: Diffused,Colorless,Rectangular; Forward Current: 20mA; Forward Voltage: 2.2V; Luminous Intensity: 25mcd; Dominant Wavelength: 572nm; Number of LEDs: 1; Viewing Angle: 160°; Supplier 1: Mouser; Stock 1: 109326; Pricing 1: 1=0.32, 10=0.216, 50=0.216, 100=0.09, 1000=0.062, 10000=0.041 (USD); Mount: Surface Mount; Case/Package: 0603; Number of Pins: 2; Case Code (Metric): 1608; Case Code (Imperial): 0603; Min Operating Temperature: -40°C; Max Operating Temperature: 85°C; Packaging: Tape and Reel; Wavelength: 572nm; Illumination Colour: Green; Package Quantity: 1; Test Current: 20mA; Lens Transparency: Diffused; Length: 1.6mm; Height: 0.65mm; Width: 0.8mm; Radiation Hardening: No; REACH SVHC: Unknown; Lead Free: Lead Free; ComponentLink1URL: https://datasheet.ciiva.com/11774/0900766b80df3ada-11774260.pdf; ComponentLink1Description: https://datasheet.ciiva.com/11774/0900766b80df3ada-11774260.pdf; ComponentLink2URL: https://datasheet.ciiva.com/3161/sml-d1-3161419.pdf; ComponentLink2Description: https://datasheet.ciiva.com/3161/sml-d1-3161419.pdf; ComponentLink3URL: https://datasheet.ciiva.com/2110/sml-d1-2110396.pdf; ComponentLink3Description: https://datasheet.ciiva.com/2110/sml-d1-2110396.pdf; ComponentLink4URL: https://datasheet.ciiva.com/2110/sml-d1-2110397.pdf; ComponentLink4Description: https://datasheet.ciiva.com/2110/sml-d1-2110397.pdf; ComponentLink5URL: https://datasheet.ciiva.com/2110/sml-d1-2110398.pdf; ComponentLink5Description: https://datasheet.ciiva.com/2110/sml-d1-2110398.pdf
D27 = TPD2EUSB30: DIODE, ESD, DUAL, USB3.0, SOT-3; E - MFG: TI; F - MFG P/N: TPD2EUSB30ADRTR; D - my Footprint: SOT-3
D28 D29 D36 = TPD4E02B04: TVS DIODE 3.6VWM 8.8VC 10USON; E - MFG: TI; F - MFG P/N: TPD4E02B04DQAR; D - my Footprint: DQA-10
J14 = Molex_1054500101: USB 3.1 Type C Receptacle SMD RA; E - MFG: Molex; D - my Footprint: Molex_105450-0101; F - MFG P/N: 105450-0101
M1 M2 = RE1C002UNTCL: MOSFET N-CH 20V 0.2A EMT3; Manufacturer 1: Rohm; Continuous Drain Current (ID): 200mA; Rds On Max: 1.2R; Input Capacitance: 25pF; Max Power Dissipation: 150mW; Supplier 1: Digi-Key; Manufacturer Part Number 1: RE1C002UNTCL; Stock 1: 941425; Pricing 1: 1=0.20000, 10=0.18200, 100=0.09930, 500=0.06112, 1000=0.04167 (USD); RoHS: Yes; Mount: Surface Mount; Case/Package: SOT-89; Packaging: Tape and Reel; Drain to Source Voltage (Vdss): 20V; Lead Free: Lead Free; ComponentLink1URL: http://www.mouser.com/ds/2/348/re1c002untcl-e-1018231.pdf?src-supplier=Mouser; ComponentLink1Description: http://www.mouser.com/ds/2/348/re1c002untcl-e-1018231.pdf?src-supplier=Mouser; ComponentLink2URL: http://rohmfs.rohm.com/en/techdata_basic/transistor/taping/EMT3_TL_taping.pdf?src-supplier=Digi-Key; ComponentLink2Description: http://rohmfs.rohm.com/en/techdata_basic/transistor/taping/EMT3_TL_taping.pdf?src-supplier=Digi-Key; ComponentLink3URL: http://rohmfs.rohm.com/en/products/databook/datasheet/discrete/transistor/mosfet/re1c002un.pdf?src-supplier=Avnet; ComponentLink3Description: http://rohmfs.rohm.com/en/products/databook/datasheet/discrete/transistor/mosfet/re1c002un.pdf?src-supplier=Avnet; ComponentLink4URL: https://www.rohm.com/datasheet/RE1C002UN/re1c002untcl-e?src-supplier=Digi-Key; ComponentLink4Description: https://www.rohm.com/datasheet/RE1C002UN/re1c002untcl-e?src-supplier=Digi-Key; ComponentLink5URL: http://www.farnell.com/datasheets/2704376.pdf?src-supplier=Newark; ComponentLink5Description: http://www.farnell.com/datasheets/2704376.pdf?src-supplier=Newark
R3 R4 = RES1: SMD Chip Resistor, 1 kohm, 50 V, 0402 [1005 Metric], 62.5 mW, ± 1%; E - MFG: WALSIN; F - MFG P/N: WR04X1001FTL; D - my Footprint: RESC0402(1005)_N
R31 R32 R183 R185 R186 R213 R214 = RES1: SMD Chip Resistor, Thick Film, 10 kohm, 50 V, 0402, 100mW, ± 1%; E - MFG: Panasonic; F - MFG P/N: ERJ2RKF1002X; D - my Footprint: RESC0402(1005)_N
R187 R190 = R_1.8M_1%_0402: RES SMD 1.8M 1% 0402 50V; E - MFG: YAGEO (PHYCOMP); F - MFG P/N: RC0402FR-071M8L; D - my Footprint: RESC0402(1005)_N
RZ28 RZ29 = RES1: Thick Film Resistors - SMD 0603 Zero Ohms; E - MFG: Panasonic; F - MFG P/N: ERJ-3GEY0R00V; D - my Footprint: RESC0603(1608)_N
TP41-TP44 = TP_SMD: circular pad test point, SMD
U61 = HD3SS3212RKSR: Two Channel Differential 2:1/1:2 10Gbps Mux/Demux; E - MFG: TEXAS INSTRUMENTS; D - my Footprint: VQFN-20; F - MFG P/N: HD3SS3212RKSR
U62 = TUSB321RWBR: USB Type-C  ™ Configuration  Channel  Logic and Port Control  with VCONN; E - MFG: TI; D - my Footprint: X2QFN-12; F - MFG P/N: TUSB321RWBR

## Sheet BK1096_Power_Supply.SchDoc: =project_title
size Tabloid; PageSetup: Record=PageOptions|CenterHorizontal=True|CenterVertical=True|PrintScale=0.73|XCorrection=1.00|YCorrection=1.00|PrintKind=0|BorderSize=5000000|LeftOffset=0|BottomOffset=0|Orientation=2|PaperLength=1000|PaperWidth=1000|Scale=100|PaperSource=7|PrintQuality=-4|MediaType=1|DitherType=10|PaperKind=A4|PrintScaleMode=1; CompanyName: Luxonis Holding; DrawnBy: Blaž Kvas; Organization: Luxonis Holding; Address1: 1925 Harmony Park Drive; Address2: Westminster, CO; Address3: 80234; Address4: United States; DocumentNumber: D000; Revision: R1M0E1; SheetNumber: 5; SheetTotal: 6
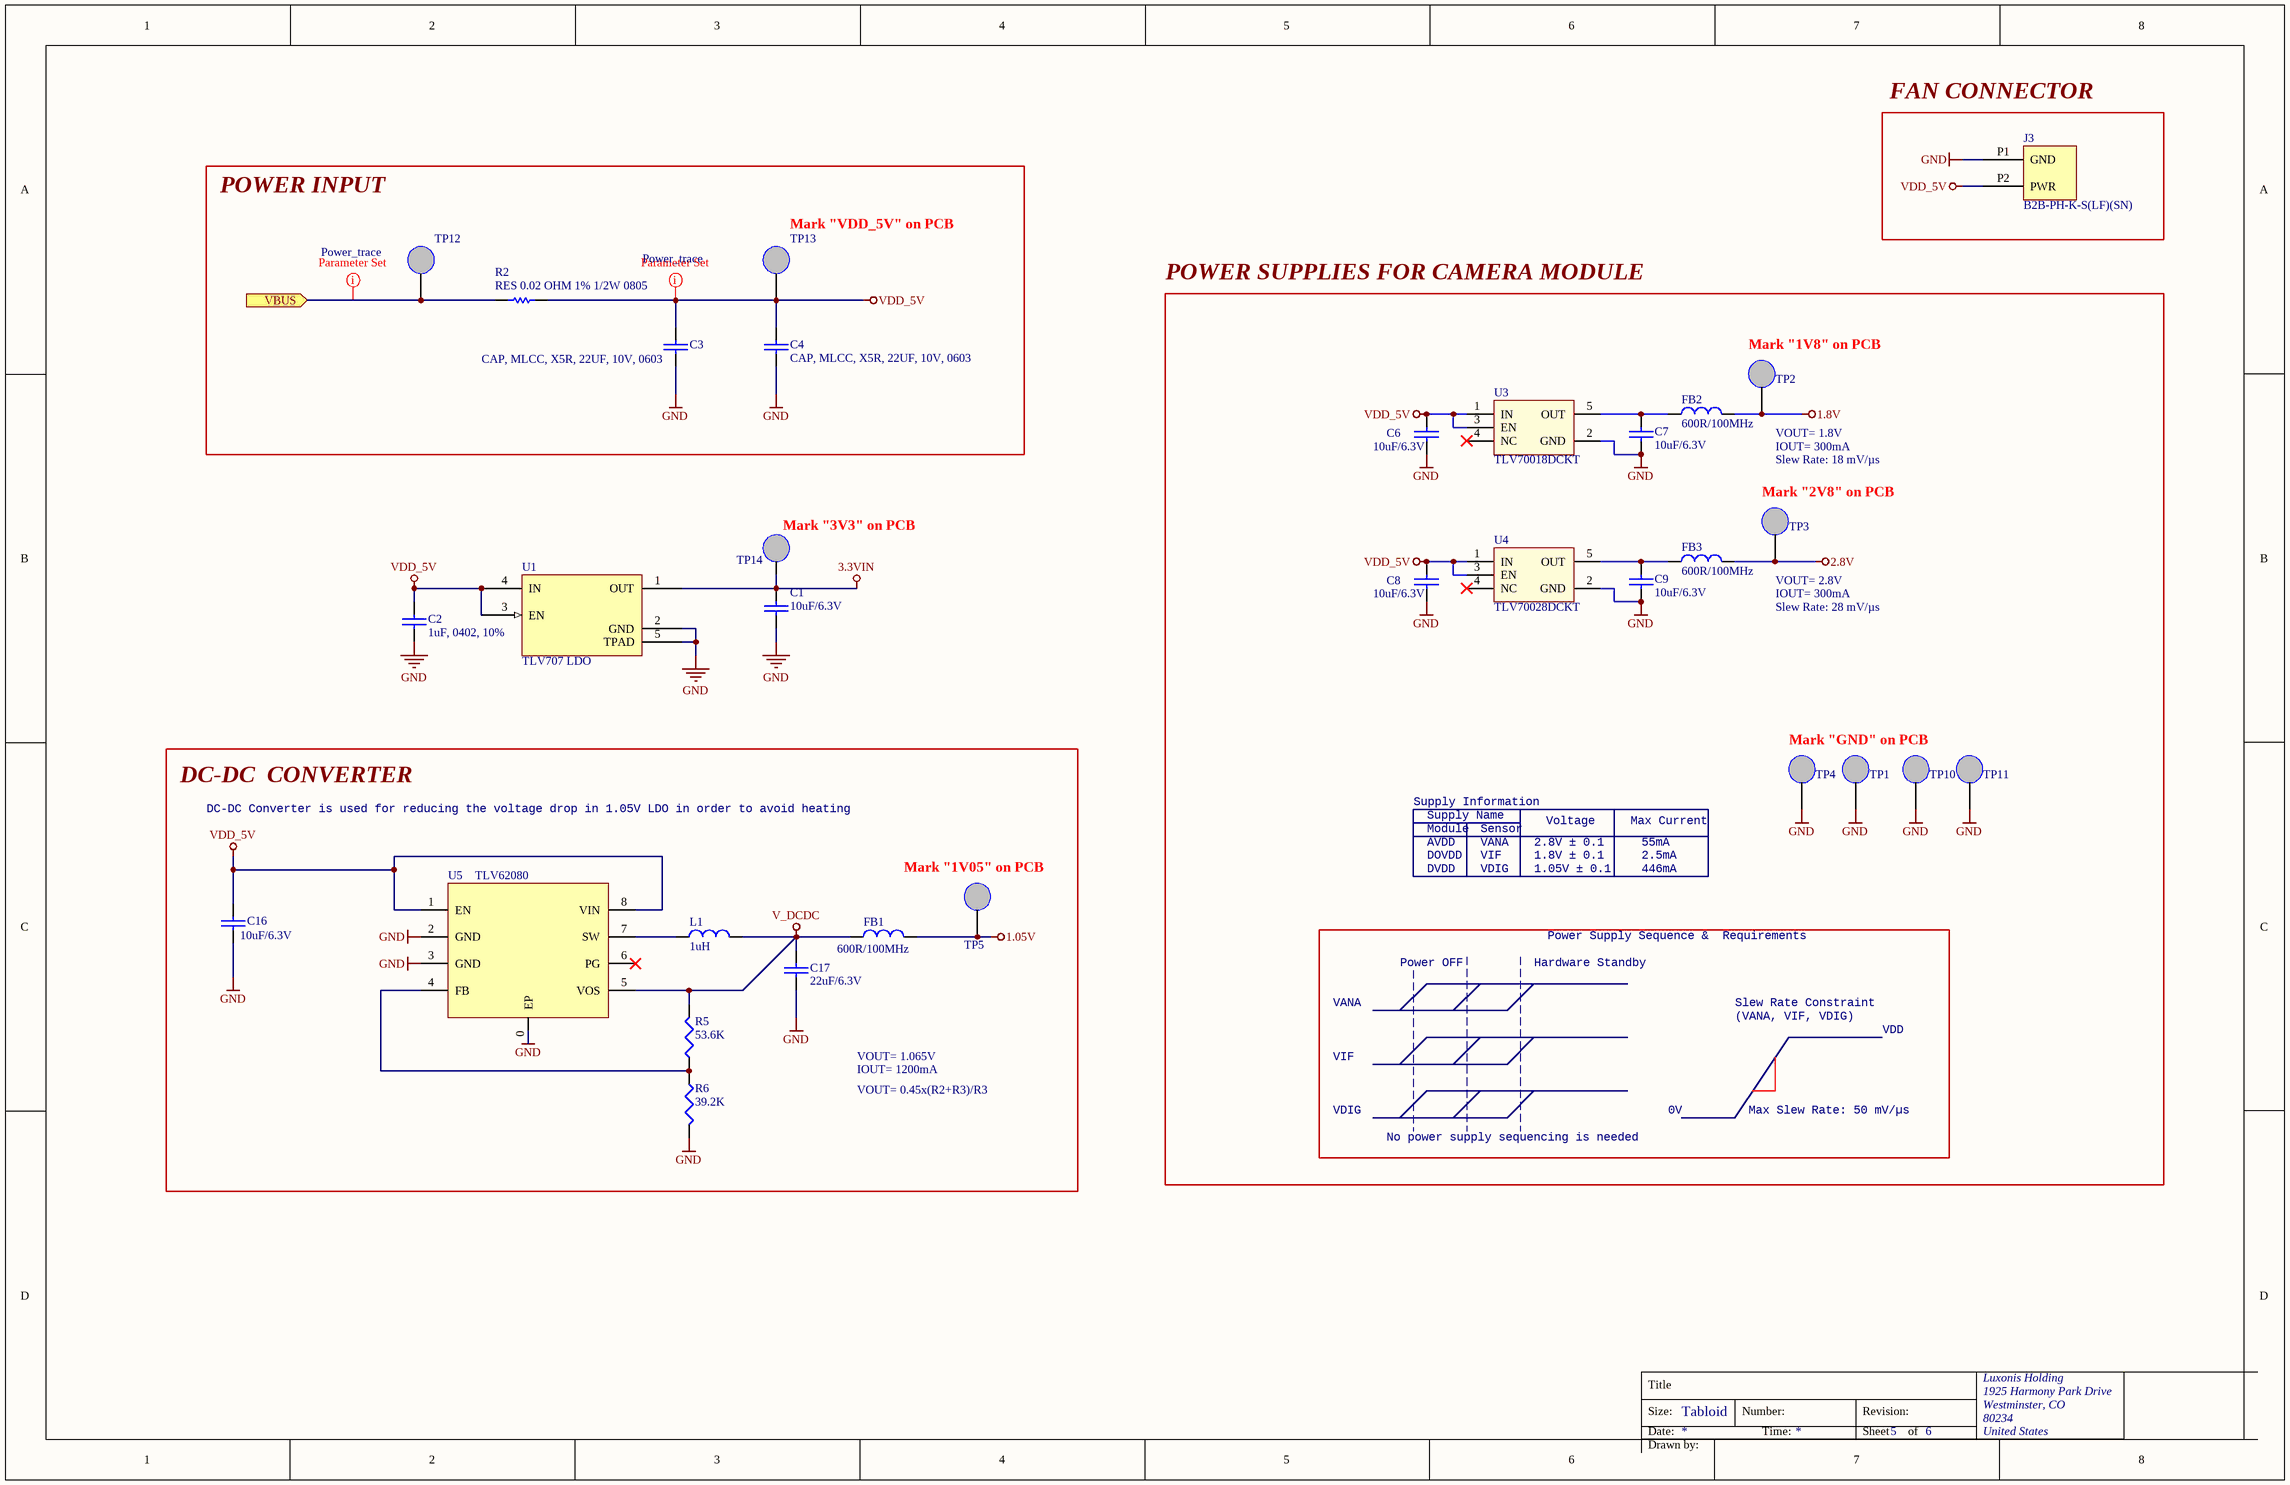
[diagram p4: BK1096_Power_Supply.SchDoc]

### Parts
C1  10uF/6.3V  [CAPC0402(1005)70_N]
C2  1uF, 0402, 10%  [CAPC0402(1005)70_N]
C3  CAP, MLCC, X5R, 22UF, 10V, 0603  [CAPC0603(1608)100_N]
C4  CAP, MLCC, X5R, 22UF, 10V, 0603  [CAPC0603(1608)100_N]
C6  10uF/6.3V  [0603]
C7  10uF/6.3V  [0603]
C8  10uF/6.3V  [0603]
C9  10uF/6.3V  [0603]
C16  10uF/6.3V  [0805]
C17  22uF/6.3V  [0805]
FB1  600R/100MHz  [0805]
FB2  600R/100MHz  [0805]
FB3  600R/100MHz  [0805]
J3  B2B-PH-K-S(LF)(SN)  [*JST_B2B-PH-K-S(LF)(SN)]
L1  1uH  [744029001]
R2  RES 0.02 OHM 1% 1/2W 0805  [RESC0805(2012)_N]
R5  53.6K  [0603]
R6  39.2K  [0603]
TP1  TP NM  [TP_SMD]  (value not drawn)  (no BOM)
TP2  TP NM  [TP_SMD]  (value not drawn)  (no BOM)
TP3  TP NM  [TP_SMD]  (value not drawn)  (no BOM)
TP4  TP NM  [TP_SMD]  (value not drawn)  (no BOM)
TP5  TP NM  [TP_SMD]  (value not drawn)  (no BOM)
TP10  TP NM  [TP_SMD]  (value not drawn)  (no BOM)
TP11  TP NM  [TP_SMD]  (value not drawn)  (no BOM)
TP12  TP NM  [TP_SMD]  (value not drawn)  (no BOM)
TP13  TP NM  [TP_SMD]  (value not drawn)  (no BOM)
TP14  TP NM  [TP_SMD]  (value not drawn)  (no BOM)
U1  TLV707 LDO  [DFN65P100X40-4L]
U3  TLV70018DCKT  [SC70-5]
U4  TLV70028DCKT  [SC70-5]
U5  TLV62080  [WSON-8]

### Blocks framed on the sheet
FAN CONNECTOR: J3
POWER INPUT: C3 C4 R2 TP12 TP13
POWER SUPPLIES FOR CAMERA MODULE: C6-C9 FB2 FB3 TP1-TP4 TP10 TP11 U3 U4
DC-DC  CONVERTER: C16 C17 FB1 L1 R5 R6 TP5 U5

### Ports
VBUS (in)

### Nets
1.05V: FB1.2 TP5.1
1.8V: FB2.2 TP2.1
2.8V: FB3.2 TP3.1
3.3VIN: C1.2 TP14.1 U1.1(OUT)
GND: C1.1 C2.2 C3.2 C4.2 C6.2 C7.2 C8.2 C9.2 C16.2 C17.2 J3.P1(GND) R6.2 TP1.1 TP4.1 TP10.1 TP11.1 U1.2(GND) U1.5(TPAD) U3.2(GND) U4.2(GND) U5.0(EP) U5.2(GND) U5.3(GND)
V_DCDC: C17.1 FB1.1 L1.1 R5.2 U5.5(VOS)
VBUS: R2.2 TP12.1 ; port VBUS
VDD_5V: C2.1 C3.1 C4.1 C6.1 C8.1 C16.1 J3.P2(PWR) R2.1 TP13.1 U1.3(EN) U1.4(IN) U3.1(IN) U3.3(EN) U4.1(IN) U4.3(EN) U5.1(EN) U5.8(VIN)
NetC7_1: C7.1 FB2.1 U3.5(OUT)
NetC9_1: C9.1 FB3.1 U4.5(OUT)
NetL1_2: L1.2 U5.7(SW)
NetR5_1: R5.1 R6.1 U5.4(FB)

Not connected (* = marked no-connect by the designer): U3 4(NC)*; U4 4(NC)*; U5 6(PG)*

### Layout directives
net class Power_trace: VBUS, VDD_5V

### Notes on the sheet
- (near TP13) Mark "VDD_5V" on PCB
- (near TP2) Mark "1V8" on PCB
- VOUT= 1.8V
- (near TP3) Mark "2V8" on PCB
- IOUT= 300mA
- Slew Rate: 18 mV/µs
- (near TP14) Mark "3V3" on PCB
- VOUT= 2.8V
- Slew Rate: 28 mV/µs
- Mark "GND" on PCB
- DC-DC Converter is used for reducing the voltage drop in 1.05V LDO in order to avoid heating
- Supply Information
- Supply Name
- Module
- Sensor
- Voltage
- Max Current
- (near TP5) Mark "1V05" on PCB
- AVDD
- DOVDD
- DVDD
- VANA
- VIF
- VDIG
- 2.8V ± 0.1
- 1.8V ± 0.1
- 1.05V ± 0.1
- 55mA
- 2.5mA
- 446mA
- Power OFF
- Hardware Standby
- Power Supply Sequence &  Requirements
- Slew Rate Constraint
- (VANA, VIF, VDIG)
- VDD
- VOUT= 1.065V
- IOUT= 1200mA
- VOUT= 0.45x(R2+R3)/R3
- No power supply sequencing is needed
- 0V
- Max Slew Rate: 50 mV/µs
- Title
- Size:
- Date:
- Tabloid
- Number:
- Time:
- Revision:
- Sheet
- of
- Drawn by:

### Library data of the parts
C1 = CAP: as C73 on sheet BK1096_USB; D - my Footprint: CAPC0402(1005)70_N
C2 = CL05A105KP5NNNC: Cap Ceramic 1uF 10V X5R 10% SMD 0402 85C Paper T/R; Manufacturer: Samsung; Supplier 1: Digi-Key; Manufacturer Part Number: CL05A105KP5NNNC; Stock 1: 13690251; Pricing 1: 1 = 0.10000, 10 = 0.04200, 100 = 0.01880, 500 = 0.01340, 1000 = 0.01053, 2500 = 0.00958, 5000 = 0.00881 (USD); RoHS: Yes; Mount: Surface Mount; Case/Package: 0402; Case Code (Metric): 1005; Case Code (Imperial): 0402; Material: Ceramic; Contact Plating: Tin; Min Operating Temperature: -55°C; Max Operating Temperature: 85°C; Capacitance: 1uF; Tolerance: 10%; Packaging: Tape and Reel; Voltage Rating: 10V; Dielectric: X5R; Package Quantity: 1; Length: 1mm; Height: 0.5mm; Width: 0.02inch; Thickness: 0.022inch; Depth: 0.5mm; Radiation Hardening: No; ComponentLink1URL: https://datasheet.ciiva.com/15195/getdatasheetpartid-358390-15195630.pdf?src-supplier=Verical; ComponentLink1Description: https://datasheet.ciiva.com/15195/getdatasheetpartid-358390-15195630.pdf?src-supplier=Verical; ComponentLink2URL: https://datasheet.ciiva.com/29198/459159-da-01-en-vs-kondensator-0402-29198341.pdf?src-supplier=Conrad; ComponentLink2Description: https://datasheet.ciiva.com/29198/459159-da-01-en-vs-kondensator-0402-29198341.pdf?src-supplier=Conrad
C3 C4 = GRM188R61A226ME15D: Manufacturer 1: *
C6-C9 = CAP: as C11 on sheet BK1096_MIPI_CAM
C16 = CAP: CERAMIC CAPACITOR, 10UF, 6.3V, X5R, 20%, 0805; MAN: TAIYO YUDEN; MAN PN: JMK212BJ106MG-T; ICCO PN: M1V10010; DIST PN: 2372273; DIST: Farnell
C17 = CAP: SMD Multilayer Ceramic Capacitor, 0805 [2012 Metric], 22 µF, 6.3 V, ± 10%, X5R; MAN: TAIYO YUDEN; MAN PN: JMK212BJ226KG-T; ICCO PN: MV122020; DIST PN: 2113069; DIST: Farnell
FB1-FB3 = INDUCTANCE1: Ferrite Bead, 600 ohm, 0805 [2012 Metric], 2 A, 0.1 ohm, ± 25%; MAN: FAIR-RITE; MAN PN: 2508056017Y2; ICCO PN: MV142024; DIST: Farnell; DIST PN: 1838838RL
J3 = B2B-PH-K-S(LF)(SN): CONN HEADER VERT 2POS 2MM; Manufacturer: JST; Number of Positions: 2; Connector Type: Male Pin; Current Rating: 2A; Gender: Male; Contact Resistance: 20mR; Insulation Resistance: 1MR; Voltage Rating: 100V; Supplier 1: Digi-Key; Manufacturer Part Number: B2B-PH-K-S(LF)(SN); Stock 1: 216199; Pricing 1: 1 = 0.170000, 10 = 0.162000, 100 = 0.100200, 500 = 0.082880, 1000 = 0.072520, 5000 = 0.062160, 10000 = 0.060440 (USD); RoHS: Yes; Mount: Through Hole; Number of Pins: 2; Contact Plating: Tin; Color: Natural; Contact Material: Brass; Housing Material: Polyamide; Housing Color: White; Min Operating Temperature: -25°C; Max Operating Temperature: 85°C; Number of Rows: 1; Packaging: Bulk; Termination: Solder; Fastening Type: Detent; Number of Poles: 2; Number of Contacts: 2; Orientation: Straight; Max Current Rating: 2A; Max Voltage Rating (AC): 100V; Voltage Rating (AC): 100V; Working Voltage: 100V; Max Voltage Rating (DC): 100V; Length: 5.9mm; Height: 9.4mm; Pitch: 2mm; Width: 4.5mm; Contact Mating Length: 0.13inch; Depth: 4.5mm; Lead Pitch: 2mm; Lead Free: Lead Free; REACH SVHC: No SVHC; ComponentLink1URL: https://datasheet.ciiva.com/6747/80560-6747392.pdf?src-supplier=Newark; ComponentLink1Description: https://datasheet.ciiva.com/6747/80560-6747392.pdf?src-supplier=Newark; ComponentLink2URL: https://datasheet.ciiva.com/11746/0900766b8082f551-11746676.pdf?src-supplier=RSComponents; ComponentLink2Description: https://datasheet.ciiva.com/11746/0900766b8082f551-11746676.pdf?src-supplier=RSComponents; ComponentLink3URL: https://datasheet.ciiva.com/8052/80560-8052022.pdf?src-supplier=Element14; ComponentLink3Description: https://datasheet.ciiva.com/8052/80560-8052022.pdf?src-supplier=Element14; ComponentLink4URL: https://datasheet.ciiva.com/712/eph-712442.pdf?src-supplier=Digi-Key; ComponentLink4Description: https://datasheet.ciiva.com/712/eph-712442.pdf?src-supplier=Digi-Key; ComponentLink5URL: https://datasheet.ciiva.com/16422/b2b-ph-k-slfsn-16422715.pdf?src-supplier=Future+Electronics; ComponentLink5Description: https://datasheet.ciiva.com/16422/b2b-ph-k-slfsn-16422715.pdf?src-supplier=Future+Electronics; Supplier Part Number 1: 455-1704-ND
L1 = INDUCTANCE1_1: FIXED IND 1UH 2.2A 55 MOHM SMD; MAN: Wurth; ICCO PN: MV249002; DIST: Farnell; DIST PN: 1635825; MAN PN: 744029001
R2 = D-100-0004
R5 = RES1: RES SMD 53.6K OHM 1% 1/10W 0603; MAN PN: CR0603-FX-5362ELF; MAN: Bourns Inc.; DIST: Digi-Key; DIST PN: CR0603-FX-5362ELFCT-ND
R6 = RES1: SMD Chip Resistor, Anti-Surge, 39.2 kohm, 150 V, 0603 [1608 Metric], 250 mW, ± 1%; MAN PN: ERJPA3F3922V; MAN: Panasonic; ICCO PN: MV249003; DIST: Farnell; DIST PN: 2562012RL
TP1-TP5 TP10-TP14 = TP: TEST POIN; MAN: SMD TESTPOINT; MAN PN: SMD TESTPOINT
U1 = TLV707: IC REG LDO 1V 0.2A 4X2SON; Manufacturer: Texas Instruments; Manufacturer Part Number: TLV70710DQNR; Output Current: 200mA; Number of Regulators: 1; Min Current Limit: 240mA; Quiescent Current: 25uA; Dropout Voltage: 250mV; Supplier 1: Digi-Key; Stock 1: 4380; Pricing 1: 1 = 0.46000, 10 = 0.37300, 100 = 0.25380, 500 = 0.19034, 1000 = 0.14276 (USD); RoHS: Yes; Mount: Surface Mount; Min Operating Temperature: -40°C; Max Operating Temperature: 125°C; Packaging: Tape and Reel; Package Quantity: 3000; Output Voltage: 1V; Lead Free: Lead Free; ComponentLink1URL: http://www.ti.com/lit/gpn/tlv707?src-supplier=Mouser; ComponentLink1Description: http://www.ti.com/lit/gpn/tlv707?src-supplier=Mouser; ComponentLink2URL: http://www.ti.com/lit/ds/symlink/tlv707.pdf?src-supplier=Digi-Key; ComponentLink2Description: http://www.ti.com/lit/ds/symlink/tlv707.pdf?src-supplier=Digi-Key
U3 = TLV70018DCKT: LDO, 200MA, 1.8V, 5SC70; MAN: TI; DIST PN: 1778221; DIST: Farnell; ICCO PN: MV198003; MAN PN: TLV70018DCKT
U4 = TLV70028DCKT: LDO, 200MA, 2.8V, 5SC70; MAN: TI; DIST PN: 1778222; DIST: Farnell; ICCO PN: MV200002; MAN PN: TLV70028DCKT
U5 = TLV62080: IC REG BUCK ADJ 1.2A SYNC 8WSON; ICCO PN: MV249006; MAN: TI; MAN PN: TLV62080DSGT; DIST: Mouser; DIST PN: 595-TLV62080DSGT

## Sheet BK1096_Project_Information.SchDoc: =project_title
size Tabloid; CompanyName: Luxonis Holding; DrawnBy: Blaž Kvas; Organization: Luxonis Holding; Address1: 1925 Harmony Park Drive; Address2: Westminster, CO; Address3: 80234; Address4: United States; DocumentNumber: D000; Revision: R1M0E1; SheetNumber: 2; SheetTotal: 6
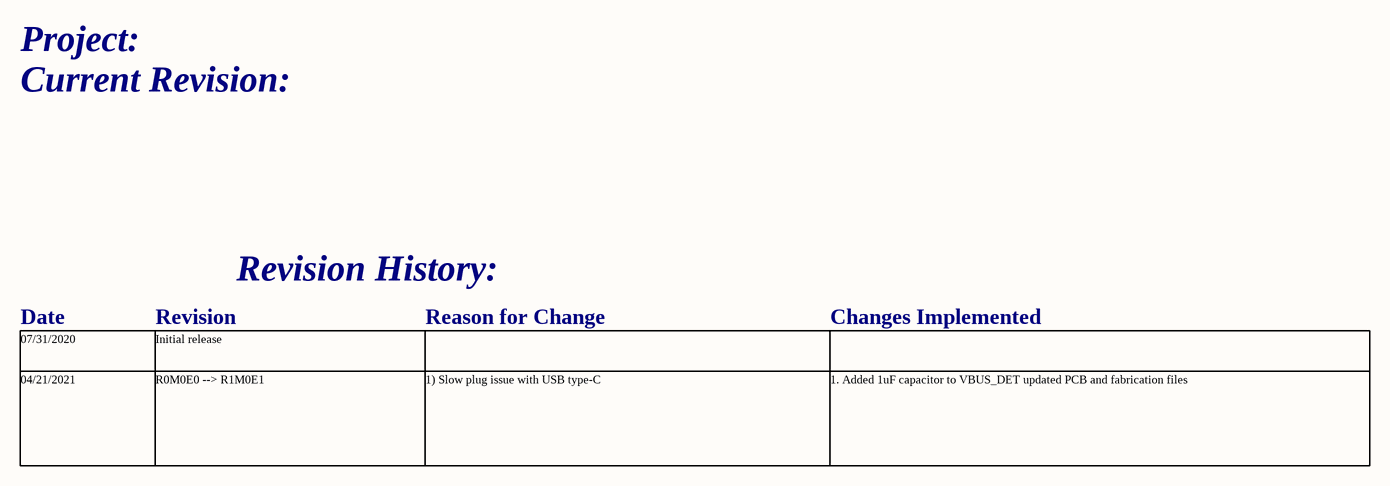
[diagram p5: BK1096_Project_Information.SchDoc]

### Notes on the sheet
- Project:
- Current Revision:
- Revision History:
- 07/31/2020
- Date
- Initial release
- Revision
- Reason for Change
- Changes Implemented
- 04/21/2021
- R0M0E0 --> R1M0E1
- 1) Slow plug issue with USB type-C
- 1. Added 1uF capacitor to VBUS_DET updated PCB and fabrication files
- Title
- Size:
- Date:
- Tabloid
- Number:
- Time:
- Revision:
- Sheet
- of
- Drawn by:

## Nets that join several sheets
1.05V: BK1096_MIPI_CAM (C10.2 C11.2 J2.15), BK1096_Power_Supply (FB1.2 TP5.1)
1.8V: BK1096_MIPI_CAM (C12.2 C13.2 J2.13), BK1096_Power_Supply (FB2.2 TP2.1)
2.8V: BK1096_MIPI_CAM (C14.2 C15.2 J2.11 J2.18), BK1096_Power_Supply (FB3.2 TP3.1)
3.3VIN: BK1096_USB (C74.2 R186.2 U61.6), BK1096_Power_Supply (C1.2 TP14.1 U1.1)
GND: BK1096_TopLevel (9 pins), BK1096_Connector (35 pins), BK1096_MIPI_CAM (16 pins), BK1096_USB (31 pins), BK1096_Power_Supply (23 pins)
VBUS: BK1096_Connector (J1.53), BK1096_USB (9 pins), BK1096_Power_Supply (R2.2 TP12.1)
VDD_5V: BK1096_Connector (7 pins), BK1096_USB (6 pins), BK1096_Power_Supply (17 pins)
CAM_A_AUX_IO1: BK1096_Connector (J1.38), BK1096_MIPI_CAM (TP7.1)
CAM_A_AUX_IO2: BK1096_Connector (J1.40), BK1096_MIPI_CAM (TP8.1)
CAM_A_C_PWM: BK1096_Connector (J1.36), BK1096_MIPI_CAM (TP6.1)
CAM_A_CLK_OUT: BK1096_Connector (J1.28), BK1096_MIPI_CAM (J2.30)
CAM_A_PWDN_N: BK1096_Connector (J1.34), BK1096_MIPI_CAM (J2.23 R1.1)
COM_AUX_IO2: BK1096_Connector (J1.42), BK1096_MIPI_CAM (TP9.1)
I2C1_SCL: BK1096_Connector (J1.35), BK1096_MIPI_CAM (J2.20)
I2C1_SDA: BK1096_Connector (J1.33), BK1096_MIPI_CAM (J2.19)
MIPI_RX4_C_N: BK1096_Connector (J1.3), BK1096_MIPI_CAM (J2.28)
MIPI_RX4_C_P: BK1096_Connector (J1.5), BK1096_MIPI_CAM (J2.27)
MIPI_RX4_D0_N: BK1096_Connector (J1.9), BK1096_MIPI_CAM (J2.5)
MIPI_RX4_D0_P: BK1096_Connector (J1.11), BK1096_MIPI_CAM (J2.6)
MIPI_RX4_D1_N: BK1096_Connector (J1.15), BK1096_MIPI_CAM (J2.26)
MIPI_RX4_D1_P: BK1096_Connector (J1.17), BK1096_MIPI_CAM (J2.25)
MIPI_RX5_D0_N: BK1096_Connector (J1.21), BK1096_MIPI_CAM (J2.8)
MIPI_RX5_D0_P: BK1096_Connector (J1.23), BK1096_MIPI_CAM (J2.9)
MIPI_RX5_D1_N: BK1096_Connector (J1.27), BK1096_MIPI_CAM (J2.2)
MIPI_RX5_D1_P: BK1096_Connector (J1.29), BK1096_MIPI_CAM (J2.3)
PGOOD: BK1096_TopLevel (TP30.1), BK1096_Connector (J1.37)
SYS_RST: BK1096_TopLevel (B1.1 TP29.1), BK1096_Connector (J1.39)
USB_D_N: BK1096_Connector (J1.18), BK1096_USB (D27.1 J14.A7 J14.B7)
USB_D_P: BK1096_Connector (J1.16), BK1096_USB (D27.2 J14.A6 J14.B6)
USB_RX_N: BK1096_Connector (J1.12), BK1096_USB (U61.4)
USB_RX_P: BK1096_Connector (J1.10), BK1096_USB (U61.3)
USB_TX_N: BK1096_Connector (J1.24), BK1096_USB (U61.8)
USB_TX_P: BK1096_Connector (J1.22), BK1096_USB (U61.7)
WAKEUP: BK1096_TopLevel (TP28.1), BK1096_Connector (J1.41)

## Assembly variants
Production: not fitted D27 D28 D29 D36 RZ28 RZ29